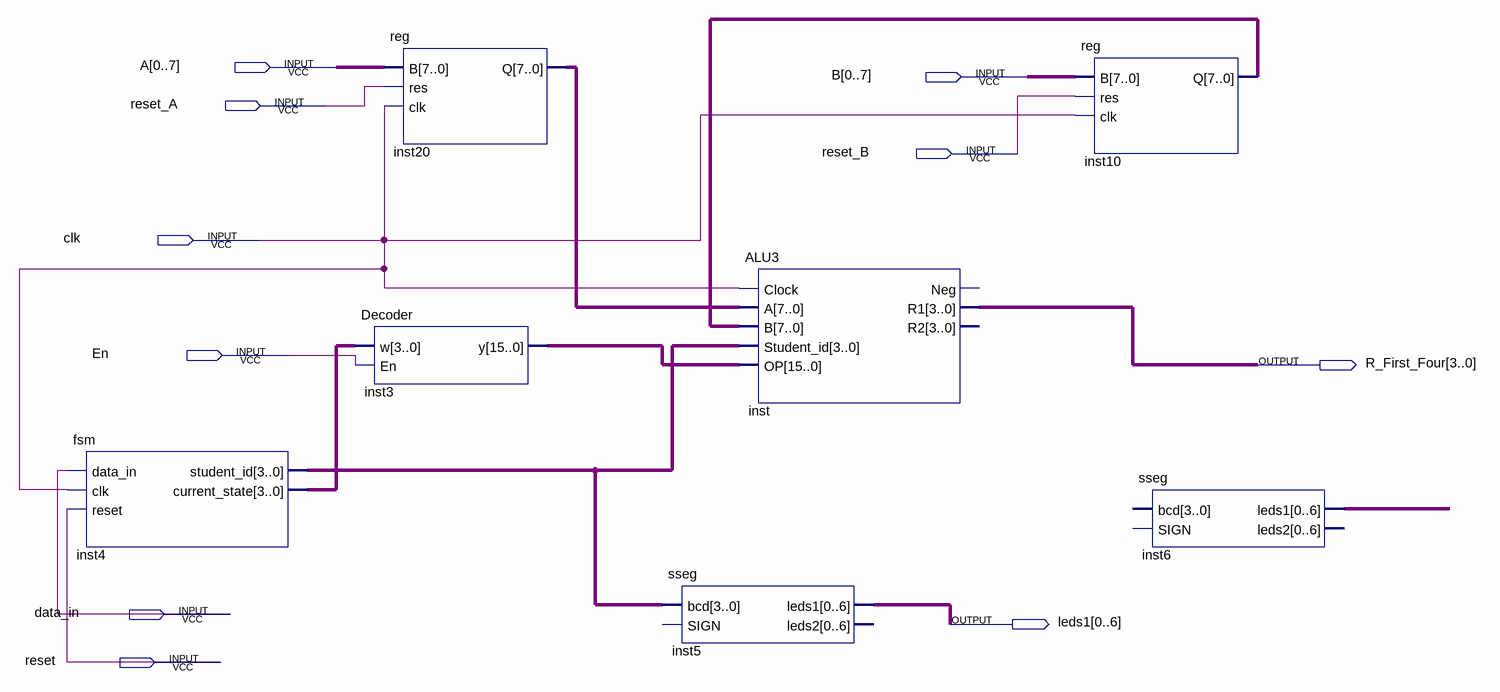
[diagram p0: schematic sheet]
// Quartus schematic block3.bdf as structural Verilog: 7 symbols, 10 pins
module block3 (
  input  [0:7] A,
  input  [0:7] B,
  input  reset_A,
  input  reset_B,
  input  clk,
  input  En,
  input  data_in,
  input  reset,
  output [3:0] R_First_Four,
  output [0:6] leds1
);

  wire [3:0] inst4_current_state, inst4_student_id;
  wire [6:0] inst6_leds1;
  wire [7:0] inst10_q, inst20_q;
  wire [15:0] inst3_y;

  fsm inst4 (
    .data_in(data_in), .clk(clk), .reset(reset), .student_id(inst4_student_id),
    .current_state(inst4_current_state));
  \reg  inst20 (.B(A), .res(reset_A), .clk(clk), .Q(inst20_q));
  Decoder inst3 (.w(inst4_current_state), .En(En), .y(inst3_y));
  sseg inst5 (.bcd(inst4_student_id), .leds1(leds1));  // open: SIGN, leds2
  ALU3 inst (
    .Clock(clk), .A(inst20_q), .B(inst10_q), .Student_id(inst4_student_id), .OP(inst3_y), .R1(R_First_Four));  // open: Neg, R2
  \reg  inst10 (.B(B), .res(reset_B), .clk(clk), .Q(inst10_q));
  sseg inst6 (.leds1(inst6_leds1));  // open: bcd, SIGN, leds2
endmodule
